# EAGLE design sensor (EAGLE 9.6.1)
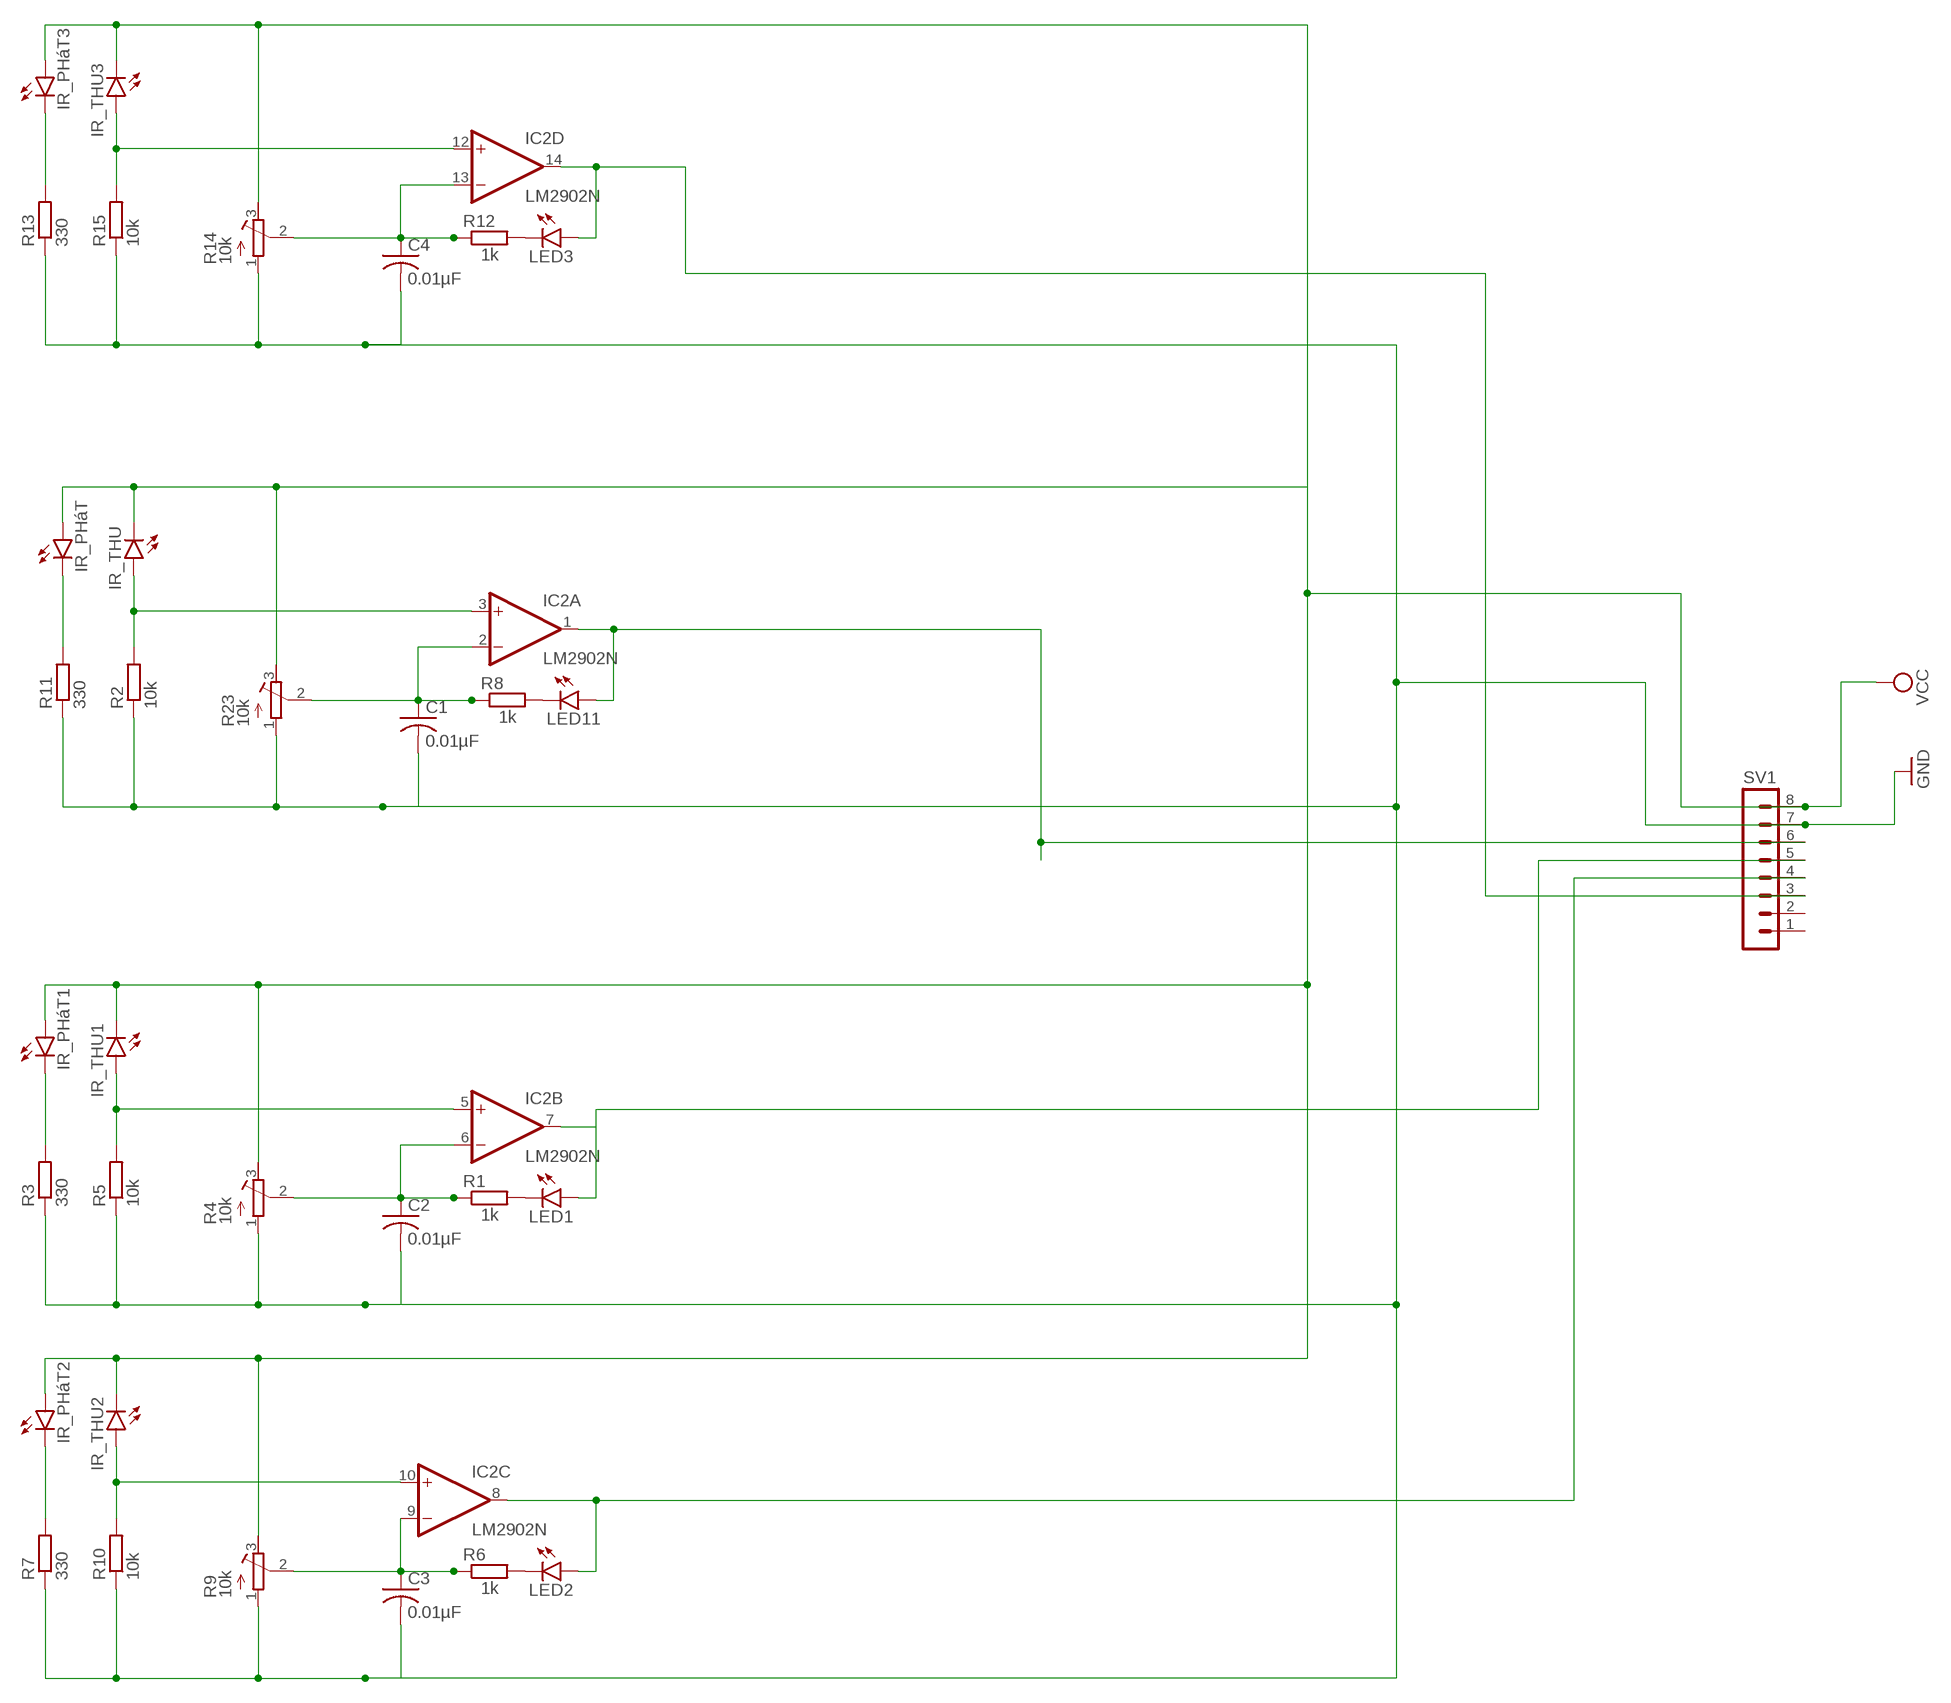
[diagram p0: schematic, sheet 1]

## Parts
C1  0.01µF  C-US025-040X050  [C025-040X050]
C2  0.01µF  C-US025-040X050  [C025-040X050]
C3  0.01µF  C-US025-040X050  [C025-040X050]
C4  0.01µF  C-US025-040X050  [C025-040X050]
IC2  LM2902N  [DIL14]
IR_PHáT  LED5MM  [LED5MM]
IR_PHáT1  LED5MM  [LED5MM]
IR_PHáT2  LED5MM  [LED5MM]
IR_PHáT3  LED5MM  [LED5MM]
IR_THU  LED5MM  [LED5MM]
IR_THU1  LED5MM  [LED5MM]
IR_THU2  LED5MM  [LED5MM]
IR_THU3  LED5MM  [LED5MM]
LED1  LED5MM  [LED5MM]
LED2  LED5MM  [LED5MM]
LED3  LED5MM  [LED5MM]
LED11  LED5MM  [LED5MM]
R1  1k  R-EU_0204/7  [0204/7]
R2  10k  R-EU_0204/7  [0204/7]
R3  330  R-EU_0204/7  [0204/7]
R4  10k  R-TRIMM3103  [RTRIM3103]
R5  10k  R-EU_0204/7  [0204/7]
R6  1k  R-EU_0204/7  [0204/7]
R7  330  R-EU_0204/7  [0204/7]
R8  1k  R-EU_0204/7  [0204/7]
R9  10k  R-TRIMM3103  [RTRIM3103]
R10  10k  R-EU_0204/7  [0204/7]
R11  330  R-EU_0204/7  [0204/7]
R12  1k  R-EU_0204/7  [0204/7]
R13  330  R-EU_0204/7  [0204/7]
R14  10k  R-TRIMM3103  [RTRIM3103]
R15  10k  R-EU_0204/7  [0204/7]
R23  10k  R-TRIMM3103  [RTRIM3103]
SV1  MA08-1W  [MA08-1W]

## Nets
GND: C1.2 C2.2 C3.2 C4.2 R2.1 R3.1 R4.1(A) R5.1 R7.1 R9.1(A) R10.1 R11.1 R13.1 R14.1(A) R15.1 R23.1(A) SV1.7
N$1: LED11.K(C) R8.2
N$2: IC2.1(A:OUT) LED11.A SV1.6
N$3: C1.1 IC2.2(A:-IN) R8.1 R23.2(S)
N$4: C2.1 IC2.6(B:-IN) R1.1 R4.2(S)
N$5: IR_PHáT.K(C) R11.2
N$6: LED1.K(C) R1.2
N$7: IC2.3(A:+IN) IR_THU.A R2.2
N$8: IR_PHáT1.K(C) R3.2
N$9: IC2.5(B:+IN) IR_THU1.A R5.2
N$10: IC2.8(C:OUT) LED2.A SV1.4
N$11: C3.1 IC2.9(C:-IN) R6.1 R9.2(S)
N$12: LED2.K(C) R6.2
N$13: IR_PHáT2.K(C) R7.2
N$14: IC2.10(C:+IN) IR_THU2.A R10.2
N$16: C4.1 IC2.13(D:-IN) R12.1 R14.2(S)
N$17: LED3.K(C) R12.2
N$18: IR_PHáT3.K(C) R13.2
N$19: IC2.12(D:+IN) IR_THU3.A R15.2
N$20: IC2.14(D:OUT) LED3.A SV1.3
N$21: IC2.7(B:OUT) LED1.A SV1.5
VCC: IR_PHáT1.A IR_PHáT2.A IR_PHáT3.A IR_PHáT.A IR_THU1.K(C) IR_THU2.K(C) IR_THU3.K(C) IR_THU.K(C) R4.3(E) R9.3(E) R14.3(E) R23.3(E) SV1.8
Unconnected: SV1.1 SV1.2

## Power pins joined to a net without a drawn wire
V-: IC2.11(P:V-)
VCC: IC2.4(P:V+)

## Library data of the parts
C1-C4 = rcl:C-US: CAPACITOR, American symbol; SPICEPREFIX: C
IC2 = linear:LM2902: Low power quad operational amplifier Source: Data sgeet <http://www.st.com/internet/com/TECHNICAL_RESOURCES/TECHNICAL_LITERATURE/DATASHEET/CD00000533.pdf>; SPICEPREFIX: J
IR_PHáT IR_PHáT1-IR_PHáT3 IR_THU IR_THU1-IR_THU3 LED1-LED3 LED11 = led:LED: LED OSRAM: - CHIPLED LG R971, LG N971, LY N971, LG Q971, LY Q971, LO R971, LY R971 LH N974, LH R974 LS Q976, LO Q976, LY Q976 LO Q996 - Hyper CHIPLED LW Q18S LB Q993, LB Q99A, LB R99A - SideLED LS A670, LO A670, LY A670, LG A670, LP A670 LB A673, LV A673, LT A673, LW A673 LH A674 LY A675 LS A676, LA A676, LO A676, LY A676, LW A676 LS A679, LY A679, LG A679 - Hyper Micro SIDELED® LS Y876, LA Y876, LO Y876, LY Y876 LT Y87S - SmartLED LW L88C, LW L88S LB L89C, LB L89S, LG L890 LS L89K, LO L89K, LY L89K LS L896, LA L896, LO L896, LY L896 - TOPLED LS T670, LO T670, LY T670, LG T670, LP T670 LSG T670, LSP T670, LSY T670, LOP T670, LYG T670 LG T671, LOG T671, LSG T671 LB T673, LV T673, LT T673, LW T673 LH T674 LS T676, LA T676, LO T676, LY T676, LB T676, LH T676, LSB T676, LW T676 LB T67C, LV T67C, LT T67C, LS T67K, LO T67K, LY T67K, LW E67C LS E67B, LA E67B, LO E67B, LY E67B, LB E67C, LV E67C, LT E67C LW T67C LS T679, LY T679, LG T679 LS T770, LO T770, LY T770, LG T770, LP T770 LB T773, LV T773, LT T773, LW T773 LH T774 LS E675, LA E675, LY E675, LS T675 LS T776, LA T776, LO T776, LY T776, LB T776 LHGB T686 LT T68C, LB T68C - Hyper Mini TOPLED® LB M676 - Mini TOPLED Santana® LG M470 LS M47K, LO M47K, LY M47K Source: http://www.osram.convergy.de LUXEON: - LUMILED® LXK2-PW12-R00, LXK2-PW12-S00, LXK2-PW14-U00, LXK2-PW14-V00 LXK2-PM12-R00, LXK2-PM12-S00, LXK2-PM14-U00 LXK2-PE12-Q00, LXK2-PE12-R00, LXK2-PE12-S00, LXK2-PE14-T00, LXK2-PE14-U00 LXK2-PB12-K00, LXK2-PB12-L00, LXK2-PB12-M00, LXK2-PB14-N00, LXK2-PB14-P00, LXK2-PB14-Q00 LXK2-PR12-L00, LXK2-PR12-M00, LXK2-PR14-Q00, LXK2-PR14-R00 LXK2-PD12-Q00, LXK2-PD12-R00, LXK2-PD12-S00 LXK2-PH12-R00, LXK2-PH12-S00 LXK2-PL12-P00, LXK2-PL12-Q00, LXK2-PL12-R00 Source: www.luxeon.com KINGBRIGHT: KA-3528ASYC Source: www.kingbright.com
R1-R3 R5-R8 R10-R13 R15 = rcl:R-EU_: RESISTOR, European symbol; SPICEPREFIX: R
R4 R9 R14 R23 = rcl:R-TRIMM: Trimm resistor; SPICEMODEL: X; SPICEPREFIXL: POT
SV1 = con-lstb:MA08-1W: PIN HEADER; OC_FARNELL: unknown; OC_NEWARK: unknown

## Board
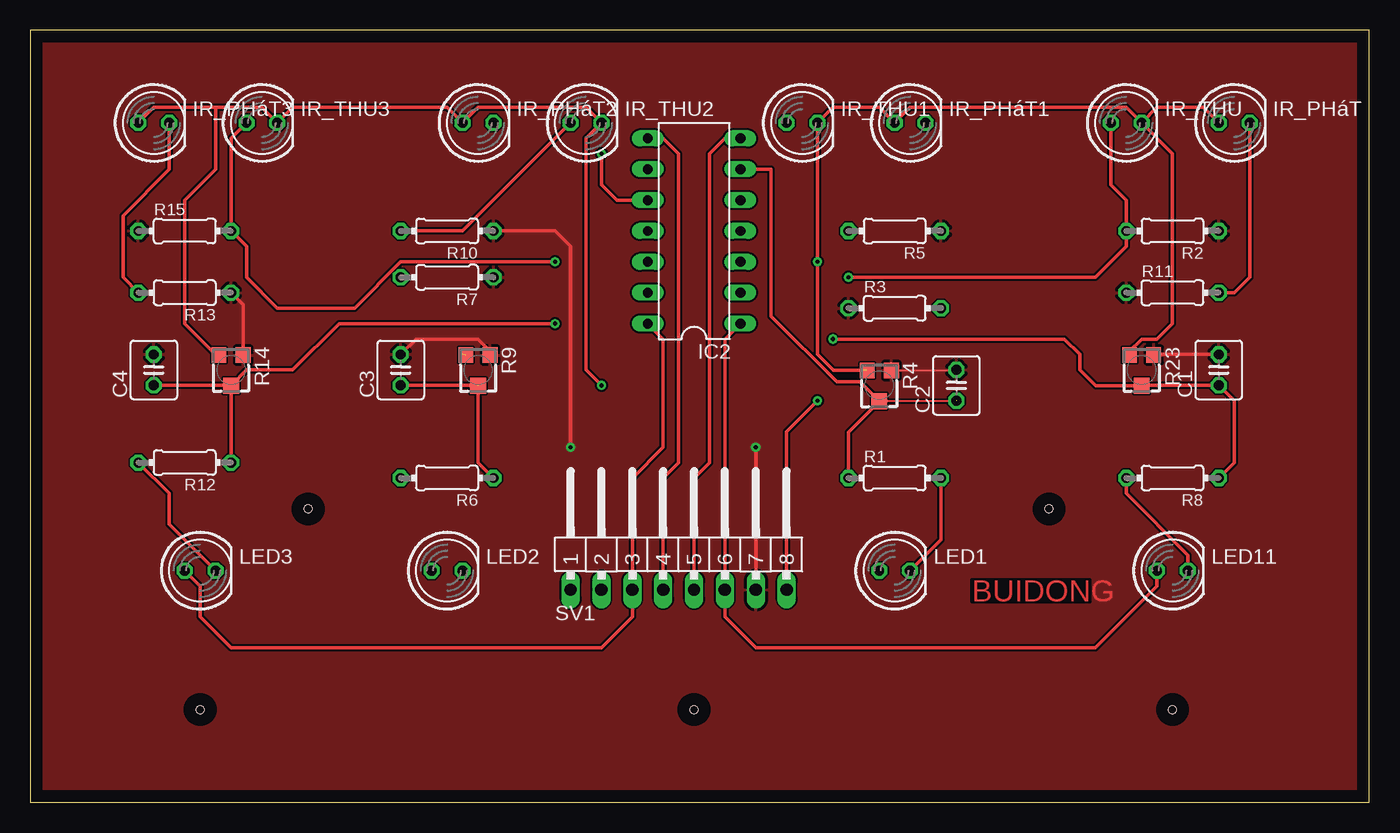
[diagram p1: board, top side]
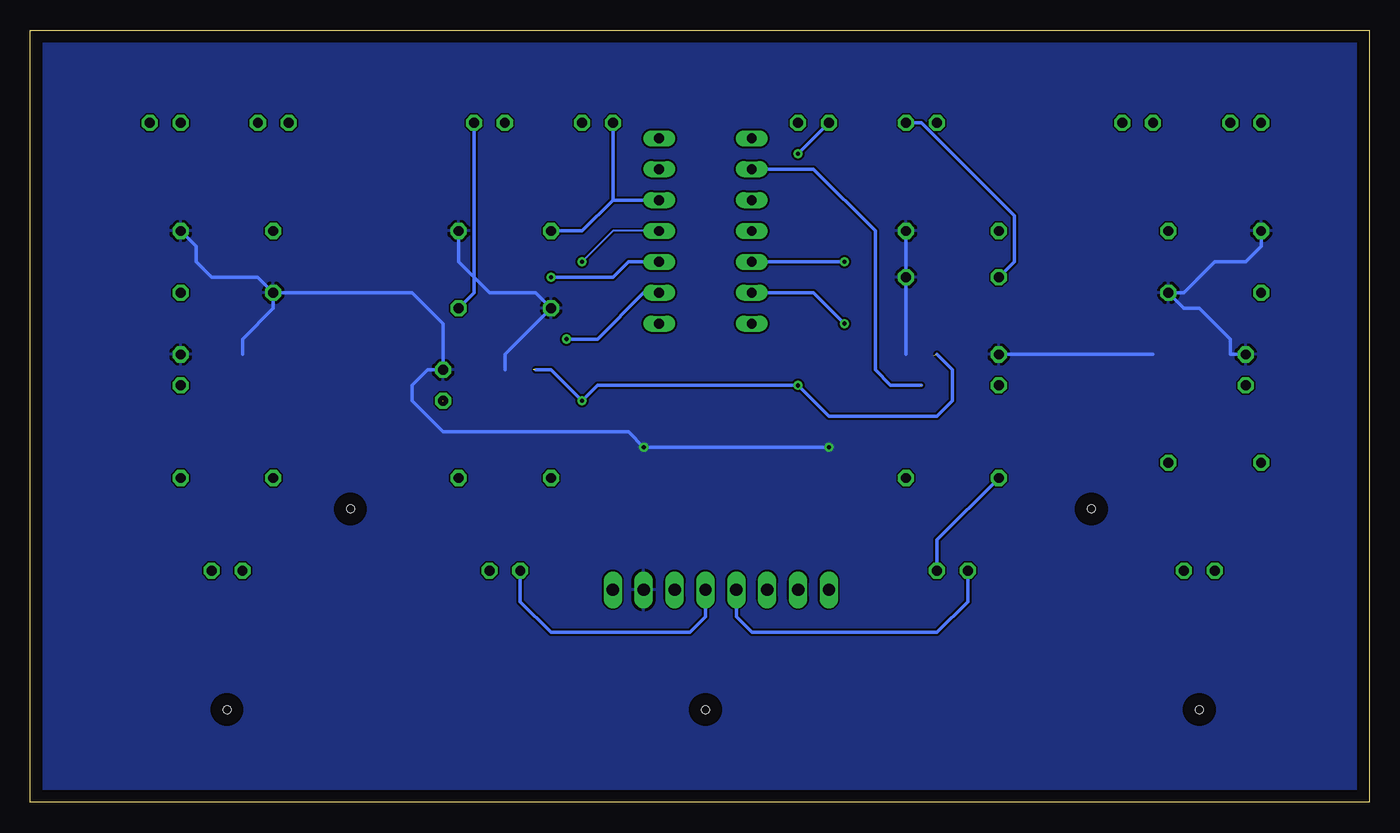
[diagram p2: board, bottom side, seen from below]

Size 110.16 x 63.49 mm. Coordinates in mm from the lower left corner, seen from the top.
Outline: 0,0 110.16,0 110.16,63.49 0,63.49 0,0
Copper layers (1*16): Top 0.035mm / dielectric 1.5mm / Bottom 0.035mm
Design rules "default": minimum track width 6mil, minimum drill 0.35mm, track to track 6mil, track to pad 6mil, pad to pad 6mil, via to via 6mil, smd to smd 6mil, copper to edge 40mil, drill to drill 6mil, minimum pad ring 10mil, minimum via ring 8mil, stop-mask expansion 4mil, vias tented up to drill 0mil, thermal gap 10mil
Holes 0.65 mm at 13.97,7.62 93.98,7.62 54.61,7.62 22.86,24.13 83.82,24.13

### Footprints (pad centres in the part's own frame; a part is rotated, then mirrored left to right if it is on the bottom)
C025-040X050 = drill 0.813 octagon: 1 -1.27,0; 2 1.27,0
DIL14 = drill 0.813 long: 1 -7.62,-3.81; 2 -5.08,-3.81; 3 -2.54,-3.81; 4 0,-3.81; 5 2.54,-3.81; 6 5.08,-3.81; 7 7.62,-3.81; 8 7.62,3.81; 9 5.08,3.81; 10 2.54,3.81; 11 0,3.81; 12 -2.54,3.81; 13 -5.08,3.81; 14 -7.62,3.81
LED5MM = drill 0.813 octagon: A -1.27,0; K 1.27,0
0204/7 = drill 0.813 octagon: 1 -3.81,0; 2 3.81,0
RTRIM3103 = smd 1.2 x 1.25: 1 -1,-1.225; 3 1,-1.225 | smd 1.3 x 1.3: 2 0,1.3
MA08-1W = drill 1.016 long: 1 -8.89,0; 2 -6.35,0; 3 -3.81,0; 4 -1.27,0; 5 1.27,0; 6 3.81,0; 7 6.35,0; 8 8.89,0

### Placement (x,y rotation side)
C1  97.79,35.56 90 top
C2  76.2,34.29 90 top
C3  30.48,35.56 90 top
C4  10.16,35.56 90 top
IC2  54.61,46.99 90 top
IR_PHáT  99.06,55.88 0 top
IR_PHáT1  72.39,55.88 0 top
IR_PHáT2  36.83,55.88 0 top
IR_PHáT3  10.16,55.88 0 top
IR_THU  90.17,55.88 0 top
IR_THU1  63.5,55.88 0 top
IR_THU2  45.72,55.88 0 top
IR_THU3  19.05,55.88 0 top
LED1  71.12,19.05 0 top
LED2  34.29,19.05 0 top
LED3  13.97,19.05 0 top
LED11  93.98,19.05 0 top
R1  71.12,26.67 0 top
R2  93.98,46.99 180 top
R3  71.12,40.64 0 top
R4  69.85,34.29 180 top
R5  71.12,46.99 180 top
R6  34.29,26.67 180 top
R7  34.29,43.18 180 top
R8  93.98,26.67 180 top
R9  36.83,35.56 180 top
R10  34.29,46.99 180 top
R11  93.98,41.91 0 top
R12  12.7,27.94 180 top
R13  12.7,41.91 180 top
R14  16.51,35.56 180 top
R15  12.7,46.99 0 top
R23  91.44,35.56 180 top
SV1  53.34,17.48 0 top

### Tracks (layer width: path | path; a pad name or v marks a point on that pad's centre or on a via)
GND  (via drill 0.35)
  Top 0.152: R4.1 75.93,35.52 75.98,35.56
  Top 0.305: R23.1 92.48,36.83 C1.2 | SV1.7 v59.69,29.21 | R9.1 37.83,37.1 36.83,38.1 31.75,38.1 C3.2 | R14.1 17.51,40.91 R13.1 | v44.45,29.21 44.45,45.72 43.18,46.99 R10.1
  Bottom 0.305: R2.1 96.52,45.72 96.52,44.45 95.25,43.18 91.44,43.18 R11.1 | R11.1 90.17,40.64 92.71,38.1 92.71,36.83 | R5.1 74.93,44.45 72.39,41.91 68.58,41.91 R3.1 71.12,36.83 71.12,35.56 | R11.1 78.74,41.91 76.2,39.37 C2.2 77.47,35.56 78.74,34.29 78.74,33.02 76.2,30.48 60.96,30.48 v59.69,29.21 v44.45,29.21 | R15.1 8.89,45.72 10.16,44.45 12.7,44.45 15.24,41.91 R13.1 15.24,40.64 13.97,40.64 11.43,38.1 11.43,36.83 C4.2 | C3.2 17.78,36.83 | R10.1 R7.1 38.1,36.83
  pour Bottom: 110.49,63.5 110.49,0 0,0 0,63.5
  pour Top: 0,63.5 110.49,63.5 110.49,0 0,0
N$1
  Top 0.305: R8.2 90.17,25.4 95.25,20.32 LED11.K
N$2
  Top 0.305: LED11.A 92.71,17.78 87.63,12.7 59.69,12.7 57.15,15.24 SV1.6 57.15,38.1 IC2.1
N$3  (via drill 0.35)
  Top 0.305: R8.1 99.06,27.94 99.06,33.02 C1.1 91.47,34.29 R23.2 87.66,34.26 86.36,35.56 86.36,36.83 85.09,38.1 v66.04,38.1
  Bottom 0.305: v66.04,38.1 63.5,38.1 59.69,41.91 IC2.2
N$4  (1 unrouted)
  Top 0.152: R4.2 76.2,32.99 76.23,33.02
  Top 0.305: R1.1 67.31,30.45 R4.2 68.25,34.59 66.37,34.59 60.96,39.99 60.96,52.07 IC2.6
N$5
  Top 0.305: IR_PHáT.K 100.33,43.18 99.06,41.91 R11.2
N$6
  Top 0.305: R1.2 74.93,21.59 LED1.K
N$7  (via drill 0.35)
  Top 0.305: IR_THU.A 88.9,50.8 90.17,49.53 R2.2 90.17,45.72 87.63,43.18 v67.31,43.18
  Bottom 0.305: v67.31,43.18 62.23,43.18 60.96,44.45 IC2.3
N$8
  Bottom 0.305: R3.2 73.66,41.91 IR_PHáT1.K
N$9
  Bottom 0.305: R5.2 64.77,46.99 62.23,49.53 | IR_THU1.A 62.23,49.53 | 62.23,49.53 IC2.5
N$10
  Top 0.305: IC2.8 52.07,54.61 53.34,53.34 53.34,27.94 52.07,26.67 SV1.4
  Bottom 0.305: LED2.A 33.02,16.51 35.56,13.97 50.8,13.97 52.07,15.24 SV1.4
N$11  (1 unrouted)
  Top 0.305: C3.1 36.8,34.29 R9.2 36.83,27.94 R6.1
  Bottom 0.305: IC2.9 45.72,52.07 40.64,46.99 40.64,35.56 39.37,34.29 36.83,34.29
N$12
  Bottom 0.305: LED2.K 35.56,21.59 R6.2
N$13
  Bottom 0.305: IR_PHáT2.K 36.83,55.88 29.21,48.26 29.21,44.45 R7.2
N$14  (via drill 0.35)
  Top 0.305: IR_THU2.A 35.56,46.99 R10.2 | IC2.10 48.26,49.53 46.99,50.8 v46.99,53.34
  Bottom 0.305: v46.99,53.34 IR_THU2.A
N$16  (via drill 0.35)
  Top 0.305: R14.2 16.48,34.29 C4.1 | R14.2 R12.1 | R14.2 17.81,35.56 21.59,35.56 25.4,39.37 v43.18,39.37
  Bottom 0.305: v43.18,39.37 45.72,41.91 IC2.13
N$17
  Top 0.305: R12.2 11.43,25.4 11.43,22.86 LED3.K
N$18
  Top 0.305: R13.2 7.62,43.18 7.62,48.26 11.43,52.07 IR_PHáT3.K
N$19  (via drill 0.35)
  Top 0.305: IR_THU3.A 16.51,54.61 R15.2 17.78,45.72 17.78,43.18 20.32,40.64 26.67,40.64 30.48,44.45 v43.18,44.45
  Bottom 0.305: v43.18,44.45 IC2.12
N$20
  Top 0.305: IC2.14 52.07,38.1 52.07,29.21 49.53,26.67 SV1.3 49.53,15.24 46.99,12.7 16.51,12.7 13.97,15.24 13.97,17.78 LED3.A
N$21
  Top 0.305: IC2.7 57.15,54.61 55.88,53.34 55.88,27.94 54.61,26.67 SV1.5
  Bottom 0.305: LED1.A 69.85,16.51 67.31,13.97 55.88,13.97 54.61,15.24 SV1.5
VCC  (via drill 0.35)  (2 unrouted)
  Top 0.152: 68.81,35.56 R4.3
  Top 0.305: IR_PHáT.A 96.52,57.15 92.71,57.15 IR_THU.K | IR_THU.K 90.17,57.15 72.39,57.15 IR_PHáT1.A 69.85,57.15 66.04,57.15 IR_THU1.K v64.77,44.45 64.77,36.83 66.09,35.52 R4.3 | IR_THU.K 93.98,53.34 93.98,39.37 92.71,38.1 91.44,38.1 90.44,37.1 R23.3 | SV1.8 62.23,30.48 v64.77,33.02 | IR_PHáT3.A 10.16,57.15 15.24,57.15 | 15.24,57.15 19.05,57.15 IR_THU3.K 21.59,57.15 34.29,57.15 IR_PHáT2.A 36.83,57.15 45.72,57.15 IR_THU2.K 45.72,54.61 45.72,35.56 v46.99,34.29 | 15.24,37.05 R14.3 15.29,36.78 12.7,39.37 12.7,49.53 15.24,52.07 15.24,57.15
  Bottom 0.152: IC2.4 62.23,46.99 v64.77,44.45
  Bottom 0.305: 68.58,35.56 67.31,35.56 v64.77,33.02 63.5,34.29 v46.99,34.29 44.45,31.75 35.56,31.75 34.29,33.02 34.29,35.56 35.56,36.83

### Text on the board
Top: BUIDONG